# EAGLE design untitled (EAGLE 6.3)
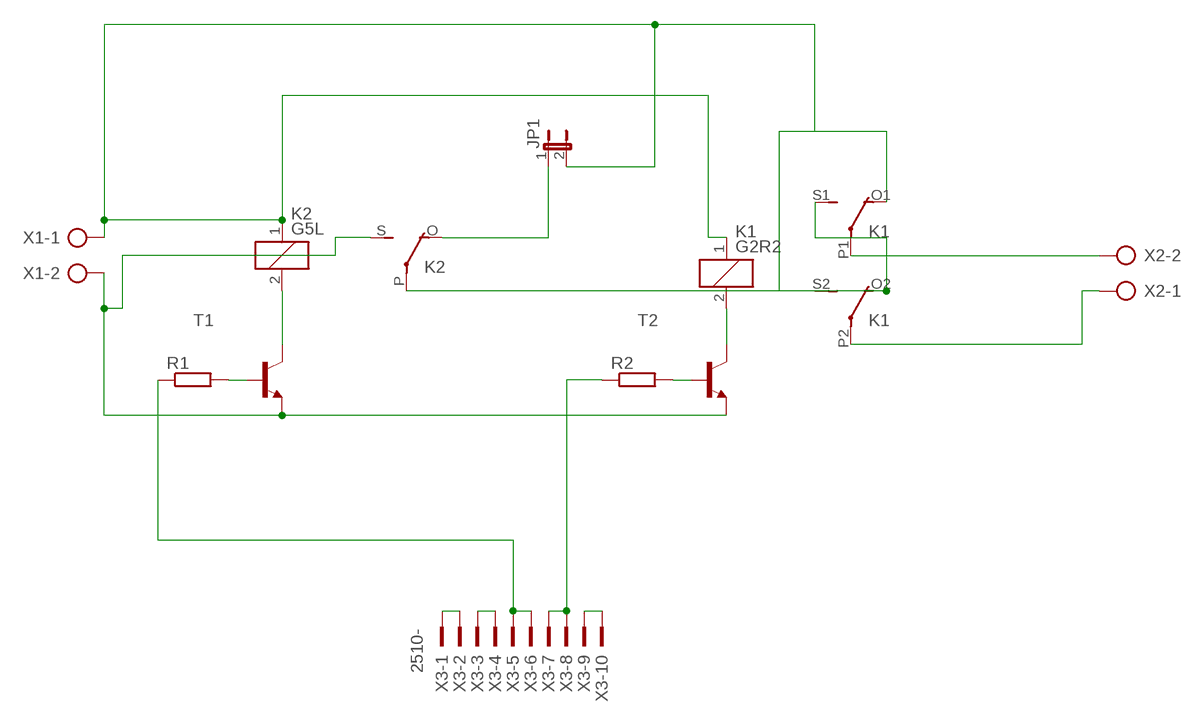
[diagram p0: schematic, sheet 1]

## Parts
JP1  JP1E  [JP1]
K1  G2R2  [G2R2]
K2  G5L  [G5LE]
R1  R-EU_0207/10  [0207/10]
R2  R-EU_0207/10  [0207/10]
T1  2N6517-NPN-TO92-CBE  [TO92-CBE]
T2  2N6517-NPN-TO92-CBE  [TO92-CBE]
X1  AK300/2  [AK300/2]
X2  AK300/2  [AK300/2]
X3  2510-  [PAK100/2500-10]

## Nets
N$1: K1.P1(2:P) X2.2
N$2: K1.P2(3:P) X2.1
N$3: K1.O2(3:O) K1.S1(2:S) K2.P(2:P)
N$5: K2.2 T1.C
N$6: X3.1 X3.2
N$7: X3.3 X3.4
N$8: R1.1 X3.5 X3.6
N$9: R2.1 X3.7 X3.8
N$10: X3.9 X3.10
N$11: R1.2 T1.B
N$12: K2.S(2:S) T1.E T2.E X1.2
N$13: JP1.1 K2.O(2:O)
N$14: R2.2 T2.B
N$15: K1.2 T2.C
N$16: JP1.2 K1.1 K1.O1(2:O) K1.S2(3:S) K2.1 X1.1

## Library data of the parts
JP1 = jumper:JP1E: JUMPER
K1 = relay:G2R2: RELAY 2 x switch, Omron; MF: OMRON COMPONENTS USA; MPN: G2R-2-DC6; OC_FARNELL: unknown; OC_NEWARK: 89C5317
K2 = relay:G5L: RELAY 1 x switch, 10 A/120 V AC, 8 A/30 V ADC, Omron; OC_FARNELL: unknown; OC_NEWARK: unknown
R1 R2 = rcl:R-EU_: RESISTOR, European symbol
T1 T2 = transistor:*-NPN-: NPN Transistror BF959 corrected 2008.03.06
X1 X2 = con-ptr500:AK300/2: CONNECTOR; OC_FARNELL: unknown; OC_NEWARK: unknown
X3 = con-3m:2510-: 3M (TM) Pak 100 4-Wall Header Source: 3M; MF: 3M; MPN: 2510-6002UB; OC_FARNELL: 9838244; OC_NEWARK: 46F4725

## Board
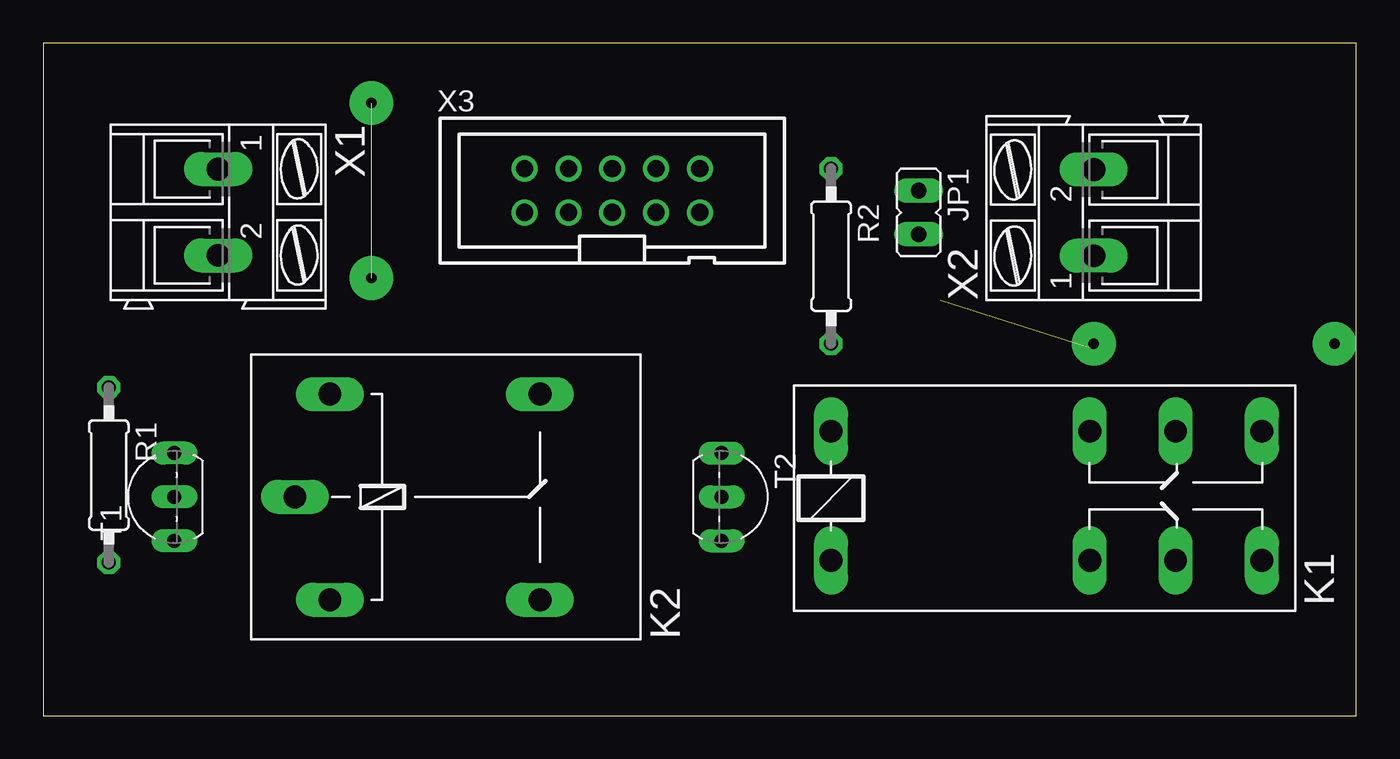
[diagram p1: board, top side]
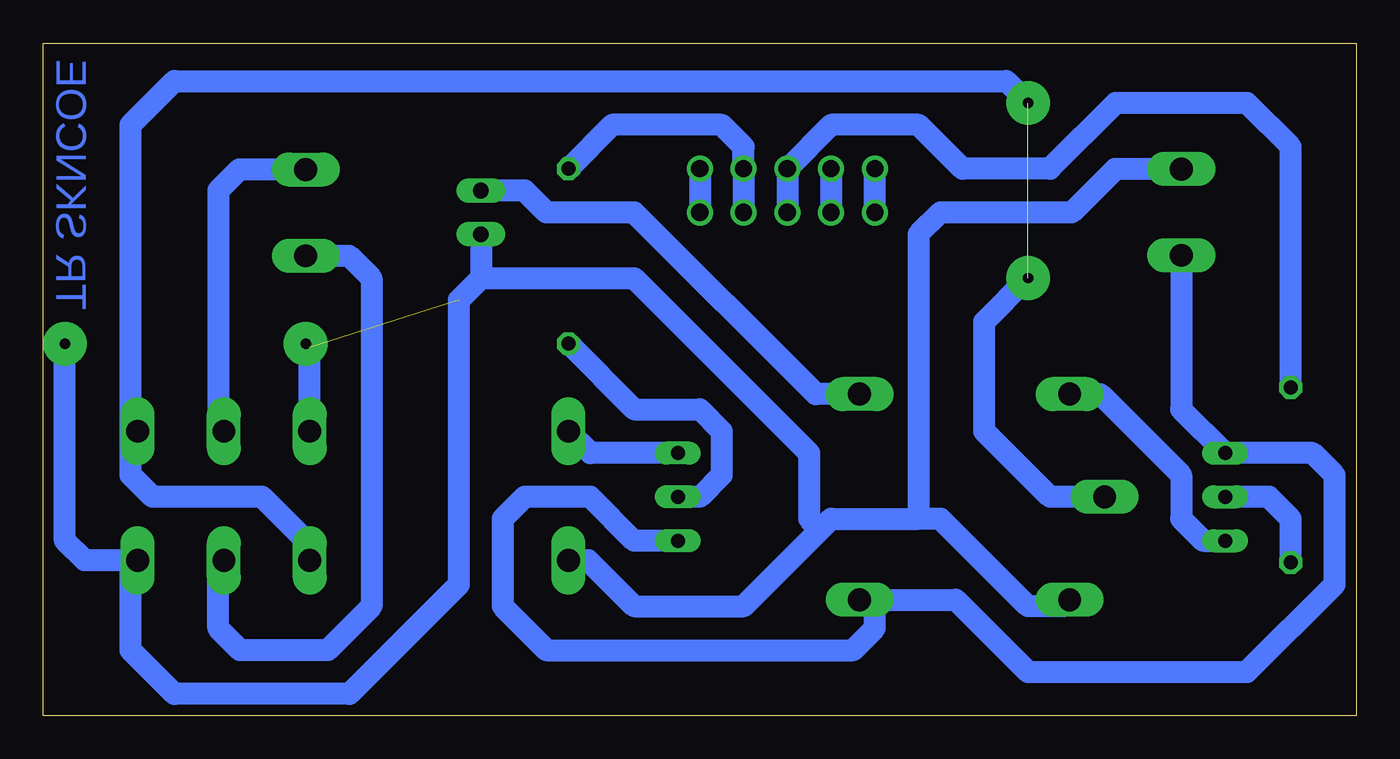
[diagram p2: board, bottom side, seen from below]

Size 76.18 x 39.04 mm. Coordinates in mm from the lower left corner, seen from the top.
Outline: 0,0 76.18,0 76.18,39.04 0,39.04 0,0
Copper layers (1*16): Top 0.035mm / dielectric 1.5mm / Bottom 0.035mm
Design rules "default": minimum track width 10mil, minimum drill 24mil, track to track 8mil, track to pad 8mil, pad to pad 8mil, via to via 8mil, smd to smd 8mil, copper to edge 40mil, drill to drill 8mil, minimum pad ring 10mil, minimum via ring 8mil, stop-mask expansion 4mil, vias tented up to drill 0mil, thermal gap 10mil

### Footprints (pad centres in the part's own frame; a part is rotated, then mirrored left to right if it is on the bottom)
JP1 = drill 0.914 long: 1 0,-1.27; 2 0,1.27
G2R2 = drill 1.321 long: 1 -2.54,-3.683; 2 -2.54,3.81; O1 12.471,3.81; O2 12.471,-3.683; P1 17.45,3.81; P2 17.45,-3.683; S1 22.454,3.81; S2 22.454,-3.683
G5LE = drill 1.321 long: 1 -7.493,-5.969; 2 -7.493,5.969; O 4.699,5.969; P -9.525,0; S 4.699,-5.969
0207/10 = drill 0.813 octagon: 1 -5.08,0; 2 5.08,0
TO92-CBE = drill 0.813 long: B 0,0; C -2.54,0; E 2.54,0
AK300/2 = drill 1.321 long: 1 -2.515,0; 2 2.489,0
PAK100/2500-10 = drill 1 pad 1.422: 1 -5.08,-1.27; 2 -5.08,1.27; 3 -2.54,-1.27; 4 -2.54,1.27; 5 0,-1.27; 6 0,1.27; 7 2.54,-1.27; 8 2.54,1.27; 9 5.08,-1.27; 10 5.08,1.27

### Placement (x,y rotation side)
JP1  50.8,29.21 180 top
K1  48.26,12.7 0 top
K2  24.13,12.7 0 top
R1  3.81,13.97 270 top
R2  45.72,26.67 270 top
T1  7.62,12.7 90 top
T2  39.37,12.7 270 top
X1  10.16,29.21 270 top
X2  60.96,29.21 90 top
X3  33.02,30.48 0 top

### Tracks (layer width: path | path; a pad name or v marks a point on that pad's centre or on a via)
N$1
  Bottom 1.27: X2.2 64.82,31.7 66.04,30.48 66.04,16.84 K1.P1
N$2
  Bottom 1.27: X2.1 58.45,26.7 57.15,25.4 57.15,6.35 59.69,3.81 64.77,3.81 66.04,5.08 66.04,8.69 K1.P2
N$3  (via drill 0.6 pad 2.54)  (1 unrouted)
  Bottom 1.27: K1.O2 60.73,9.93 63.5,12.7 69.85,12.7 71.12,13.97 71.12,16.1 | 71.12,16.1 K1.S1 | 71.12,16.1 71.12,34.29 68.58,36.83 20.32,36.83 19.05,35.56 | K2.P 17.78,12.7 21.59,16.51 21.59,22.86 v19.05,25.4
N$4  (via drill 0.6 pad 2.54)
  other vias: 60.96,21.59
N$5
  Bottom 1.27: K2.2 14.86,18.67 10.16,13.97 10.16,11.43 8.89,10.16 T1.C
N$6
  Bottom 1.27: X3.1 X3.2
N$7
  Bottom 1.27: X3.4 X3.3
N$8
  Bottom 1.27: R1.1 3.81,33.02 6.35,35.56 13.97,35.56 17.78,31.75 22.86,31.75 25.4,34.29 30.48,34.29 X3.6 X3.5
N$9
  Bottom 1.27: X3.7 X3.8 35.56,33.02 36.83,34.29 43.18,34.29 R2.1
N$10
  Bottom 1.27: X3.10 X3.9
N$11
  Bottom 1.27: R1.2 3.81,11.43 5.08,12.7 T1.B
N$12
  Bottom 1.27: X1.2 10.16,17.78 T1.E 2.54,15.24 1.27,13.97 1.27,7.62 6.35,2.54 19.05,2.54 23.24,6.73 27.94,6.73 | K2.S 27.94,6.73 | T2.E 41.91,10.16 44.45,12.7 48.26,12.7 49.53,11.43 49.53,6.35 46.99,3.81 29.21,3.81 27.94,5.08 27.94,6.73
N$13
  Bottom 1.27: K2.O 31.37,18.67 41.91,29.21 46.99,29.21 48.26,30.48 JP1.1
N$14
  Bottom 1.27: R2.2 41.91,17.78 38.1,17.78 36.83,16.51 36.83,13.97 38.1,12.7 T2.B
N$15
  Bottom 1.27: T2.C 44.45,15.24 K1.2
N$16  (1 unrouted)
  Bottom 1.27: X1.1 13.99,31.73 16.51,29.21 24.13,29.21 25.4,27.94 25.4,11.43 | K2.1 17.02,6.35 19.05,6.35 24.13,11.43 25.4,11.43 | K1.1 44.58,9.02 41.91,6.35 35.56,6.35 31.11,10.79 | 31.11,10.79 30.48,11.43 25.4,11.43 | 74.93,21.59 74.93,10.16 73.79,9.02 K1.S2 71.12,8.61 71.12,3.81 68.58,1.27 58.42,1.27 52.07,7.62 52.07,24.13 50.8,25.4 | K1.O1 60.73,21.36 60.96,21.59 | JP1.2 50.8,25.4 | 50.8,25.4 41.91,25.4 31.75,15.24 31.75,11.43 31.11,10.79
N$17  (via drill 0.6 pad 2.54)
  other vias: 19.05,35.56
N$18  (via drill 0.6 pad 2.54)
  other vias: 74.93,21.59

### Text on the board
Bottom: TR SKNCOE